# Altium schematic sheet Control and gauge.SchDoc
size A4; Organization: Altium Limited; Address1: L3, 12a Rodborough Rd; Address2: Frenchs Forest; Address3: NSW; Address4: Australia 2086; SheetNumber: 4; SheetTotal: 5
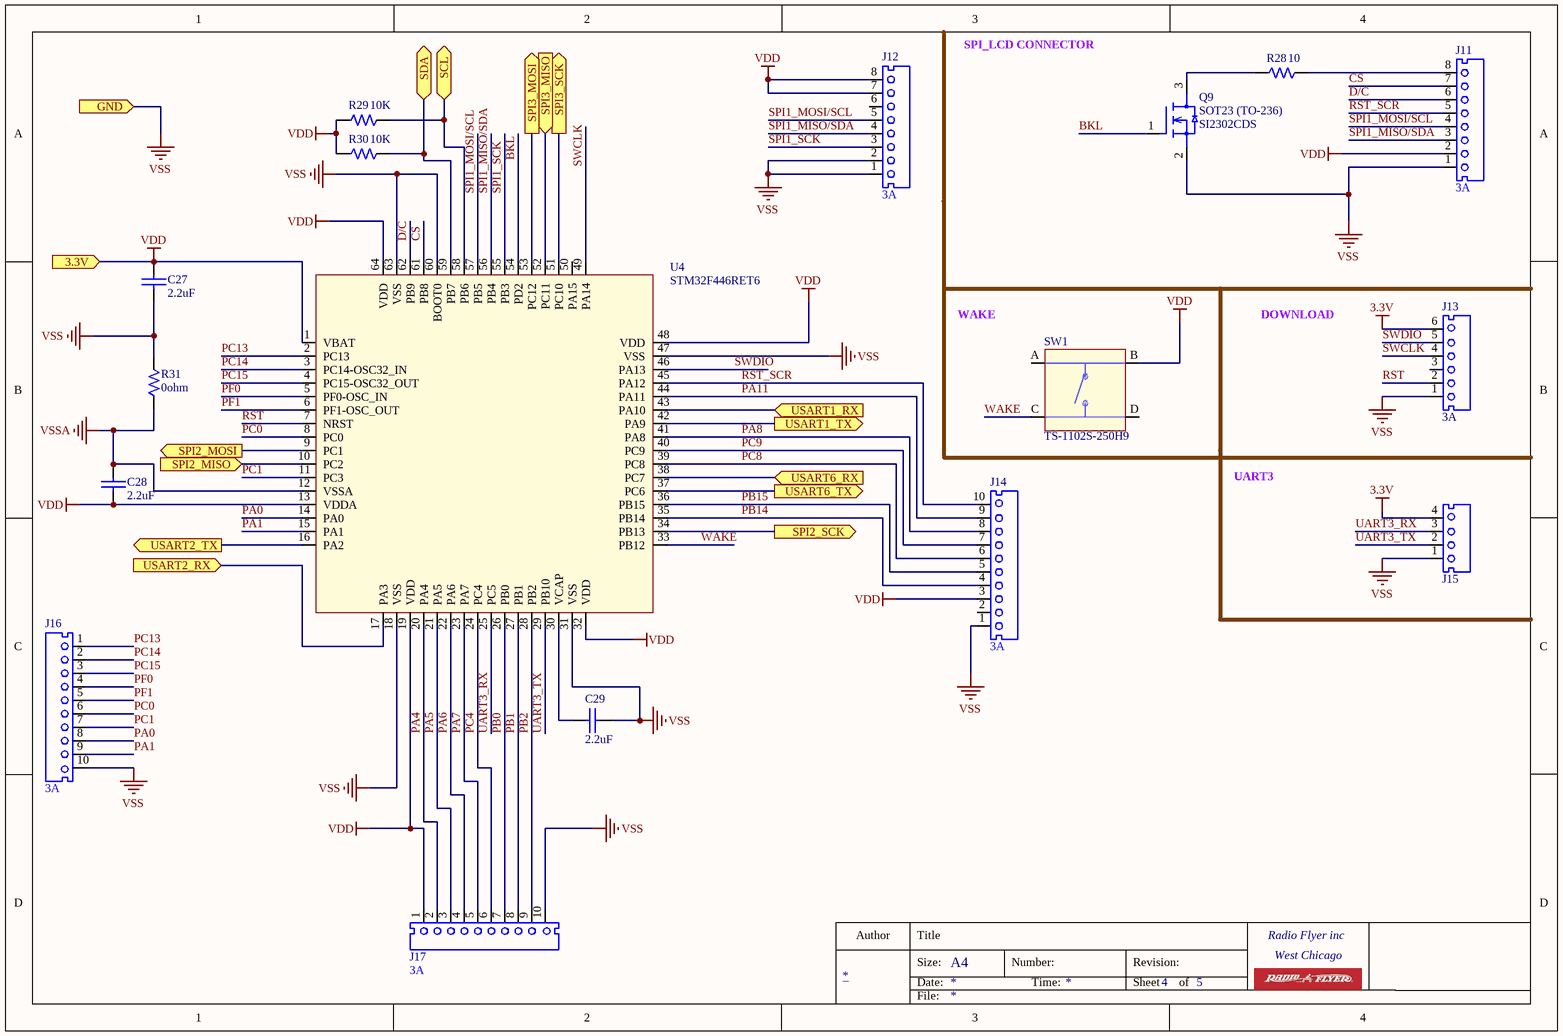
[diagram p0: Control and gauge.SchDoc]

## Parts
C27  value 2.2uF  [CAPC0603-RW]  (hidden comment: T542021037308)
C28  value 2.2uF  [CAPC0603-RW]  (hidden comment: T542021037308)
C29  value 2.2uF  [CAPC0603-RW]  (hidden comment: T542021037308)
J11  Current: 3A  [CONN 8P PH=2.5 ST TJC3-8A-CS]  (hidden comment: T690300135100)
J12  Current: 3A  [CONN 8P PH=2.5 ST TJC3-8A-CS]  (hidden comment: T690300135100)
J13  Current: 3A  [CONN 6P PH=2.5mm B6B-XH-A]  (hidden comment: CCN250000-0106)
J14  Current: 3A  [CONN 10P PH=2.5 ST TJC3-10A-CS]  (hidden comment: T690300163300)
J15  T690300164400  [CONN 4P PH=2.5mm 440052-4]  (value not drawn)
J16  Current: 3A  [CONN 10P PH=2.5 ST TJC3-10A-CS]  (hidden comment: T690300163300)
J17  Current: 3A  [CONN 10P PH=2.5 ST TJC3-10A-CS]  (hidden comment: T690300163300)
Q9  Package: SOT23 (TO-236)  [SOT23-132-RW]  (hidden comment: SI2302CDS)
R28  value 10  [0603-RW]  (hidden comment: T502976002399)
R29  value 10K  [0603-RW]  (hidden comment: T502976002399)
R30  value 10K  [0603-RW]  (hidden comment: T502976002399)
R31  value 0ohm  [0603-RW]  (hidden comment: T502976002399)
SW1  MFG Part: TS-1102S-250H9  [TACT SW TS-1102S-250H9]  (hidden comment: T670200014500)
U4  MFG Part: STM32F446RET6  [QFP50P1200X1200X160-64N]  (hidden comment: T610300097225)

## Ports
3.3V (in), GND (in), SCL (bidir), SDA (bidir), SPI2_MISO (in), SPI2_MOSI (out), SPI2_SCK (out), SPI3_MISO (in), SPI3_MOSI (out), SPI3_SCK (out), USART1_RX (in), USART1_TX (out), USART2_RX (in), USART2_TX (out), USART6_RX (in), USART6_TX (out)

## Nets
3.3V: J13.6 J15.4
VDD: C27.2 C28.1 J11.2 J12.7 J12.8 J14.3 J17.1 R29.1 R30.1 SW1.B U4.1(VBAT) U4.13(VDDA) U4.19(VDD) U4.32(VDD) U4.48(VDD) U4.64(VDD) ; port 3.3V
VSS: C27.1 C29.1 J11.1 J12.1 J12.2 J13.1 J14.1 J15.1 J16.10 J17.10 Q9.2(S) R31.2 U4.18(VSS) U4.31(VSS) U4.47(VSS) U4.60(BOOT0) U4.63(VSS) ; port GND
VSSA: C28.2 R31.1 U4.12(VSSA)
BKL: Q9.1(G) U4.54(PD2)
CS: J11.7 U4.61(PB8)
D/C: J11.6 U4.62(PB9)
PA0: J16.8 U4.14(PA0)
PA1: J16.9 U4.15(PA1)
PA4: J17.2 U4.20(PA4)
PA5: J17.3 U4.21(PA5)
PA6: J17.4 U4.22(PA6)
PA7: J17.5 U4.23(PA7)
PA8: J14.8 U4.41(PA8)
PA11: J14.9 U4.44(PA11)
PB0: J17.7 U4.26(PB0)
PB1: J17.8 U4.27(PB1)
PB2: J17.9 U4.28(PB2)
PB14: J14.4 U4.35(PB14)
PB15: J14.5 U4.36(PB15)
PC0: J16.6 U4.8(PC0)
PC1: J16.7 U4.11(PC3)
PC4: J17.6 U4.24(PC4)
PC8: J14.6 U4.39(PC8)
PC9: J14.7 U4.40(PC9)
PC13: J16.1 U4.2(PC13)
PC14: J16.2 U4.3(PC14-OSC32_IN)
PC15: J16.3 U4.4(PC15-OSC32_OUT)
PF0: J16.4 U4.5(PF0-OSC_IN)
PF1: J16.5 U4.6(PF1-OSC_OUT)
RST: J13.2 U4.7(NRST)
RST_SCR: J11.5 J14.10 U4.45(PA12)
SCL: R29.2 U4.58(PB6) ; port SCL
SDA: R30.2 U4.59(PB7) ; port SDA
SPI1_MISO/SDA: J11.3 J12.4 U4.56(PB4)
SPI1_MOSI/SCL: J11.4 J12.5 U4.57(PB5)
SPI1_SCK: J12.3 U4.55(PB3)
SPI2_MISO: U4.10(PC2) ; port SPI2_MISO
SPI2_MOSI: U4.9(PC1) ; port SPI2_MOSI
SPI2_SCK: U4.34(PB13) ; port SPI2_SCK
SPI3_MISO: U4.52(PC11) ; port SPI3_MISO
SPI3_MOSI: U4.53(PC12) ; port SPI3_MOSI
SPI3_SCK: U4.51(PC10) ; port SPI3_SCK
SWCLK: J13.4 U4.49(PA14)
SWDIO: J13.5 U4.46(PA13)
UART3_RX: J15.3 U4.25(PC5)
UART3_TX: J15.2 U4.29(PB10)
USART1_RX: U4.43(PA10) ; port USART1_RX
USART1_TX: U4.42(PA9) ; port USART1_TX
USART2_RX: U4.17(PA3) ; port USART2_RX
USART2_TX: U4.16(PA2) ; port USART2_TX
USART6_RX: U4.38(PC7) ; port USART6_RX
USART6_TX: U4.37(PC6) ; port USART6_TX
WAKE: SW1.C U4.33(PB12)
NetC29_2: C29.2 U4.30(VCAP)
NetJ11_8: J11.8 R28.2
NetQ9_3: Q9.3(D) R28.1

Not connected (* = marked no-connect by the designer): J12 6; J13 3; J14 2; SW1 A D; U4 50(PA15)

## Notes on the sheet
- SPI_LCD CONNECTOR
- WAKE
- DOWNLOAD
- UART3
- Author
- Title
- Size:
- Date:
- A4
- Number:
- Time:
- Revision:
- Sheet
- of
- Radio Flyer inc
- West Chicago
- File:

## Library data of the parts
C27-C29 = CAP0603 0.01uF 16V 10%_X7R_WALSIN: CAP X7R .01UF 16V +-10% 0603 WALSIN L; Tolerance: 10%; Type: Capacitor; CREATE_NAME: Nathan; DIP&SMD: SMD; SAP: T542021037308; PACKAGE: CAPC0603; Vendor Name: *; MFG: WALSIN; MFG Part: *; Other: X7R; CREATE_TIME: 13-July-2016; Customer Specific: N/A; Voltage: 16V
J11 J12 = CONN 8P PH=2.5 ST TJC3-8A-CS: CONN 8PIN P2.5 M\180 TJC3-8A-CS K; Value: 2.5mm; MFG: JINJIA; CREATE_NAME: Nathan; DIP&SMD: DIP; SAP: T690300135100; MFG Part: TJC3-8A-CS; Vendor Name: *; Vendor Code: *; Type: Connector; CREATE_TIME: 21-Mar-2018
J13 = CONN 6P PH=2.5mm B6B-XH-A: GP CONNECTOR B6B-XH-A 6 PIN; Value: 2.5mm; SAP: T690300041300; Vendor Name: 亿源电子有限公司; Vendor Code: 10009989; DIP&SMD: DIP; MFG: *; MFG Part: *; Type: Connector
J14 J16 J17 = CONN 10P PH=2.5 ST TJC3-10A-CS: CONN 10PIN P2.5 M\180 TJC3-10A-CS K; Value: 2.5mm; MFG: JINJIA; CREATE_NAME: Nathan; DIP&SMD: DIP; SAP: T690300163300; MFG Part: TJC3-10A-CS; Vendor Name: *; Vendor Code: *; Type: Connector; CREATE_TIME: 19-Mar-2019
J15 = CONN 4P PH=2.5mm 440052-4_TE: GP CONNECTOR B4B-XH-A 4 PIN; Value: 2.5mm; MFG: TE; DIP&SMD: DIP; CREATE_NAME: Nathan; SAP: T690300164400; MFG Part: 440052-4; Vendor Name: *; Vendor Code: *; Type: Connector; CREATE_TIME: 10-APR-2019; Current: *
Q9 = SI2302CDS: NMOS FET-Si2302CDS; MFG: VISHAY; CREATE_NAME: Nathan; DIP&SMD: SMD; SAP: *; Power: *; Vendor Code: *; Vendor Name: *; Voltage: *; Current: *; Type: NMOS; CREATE_TIME: 17-Nov-2020; Customer Specific: N/A; MFG Part: SI2302CDS
R28-R31 = RES0603 1/10W +-1% 976 OHM 100PPM: CHIP 976 OHM 100PPM +-1% 0603 WALS L; Power: 0.1W; MFG: WALSIN; CREATE_NAME: Tom; DIP&SMD: SMD; Vendor Code: *; SAP: T502976002399; Vendor Name: *; MFG Part: *; Type: Resistor; CREATE_TIME: 17-Dec-2015; PACKAGE: 0603; TOL: +-1%; Customer Specific: N/A
SW1 = TACT SW TS-1102S-250H9: TACT SW TS-1102S-250H9 JINGJU K; Current: 50mA; Voltage: 12V; CREATE_NAME: Nathan; DIP&SMD: SMD; SAP: T670200014500; MFG: JINGJU; Vendor Code: *; Vendor Name: *; Value: TACT; Type: Switch; CREATE_TIME: 07-May-2019; Customer Specific: N/A
U4 = STM32F030RCT6TR: MCU STM32F030RCT6TR LQFP64 ST K; MFG: ST     (STM意法半導體); CREATE_NAME: Nathan; DIP&SMD: SMD; SAP: T610300097225; Type: IC; CREATE_TIME: 02-NOV-2017; Customer Specific: N/A